# EAGLE design PB (EAGLE 9.5.2)
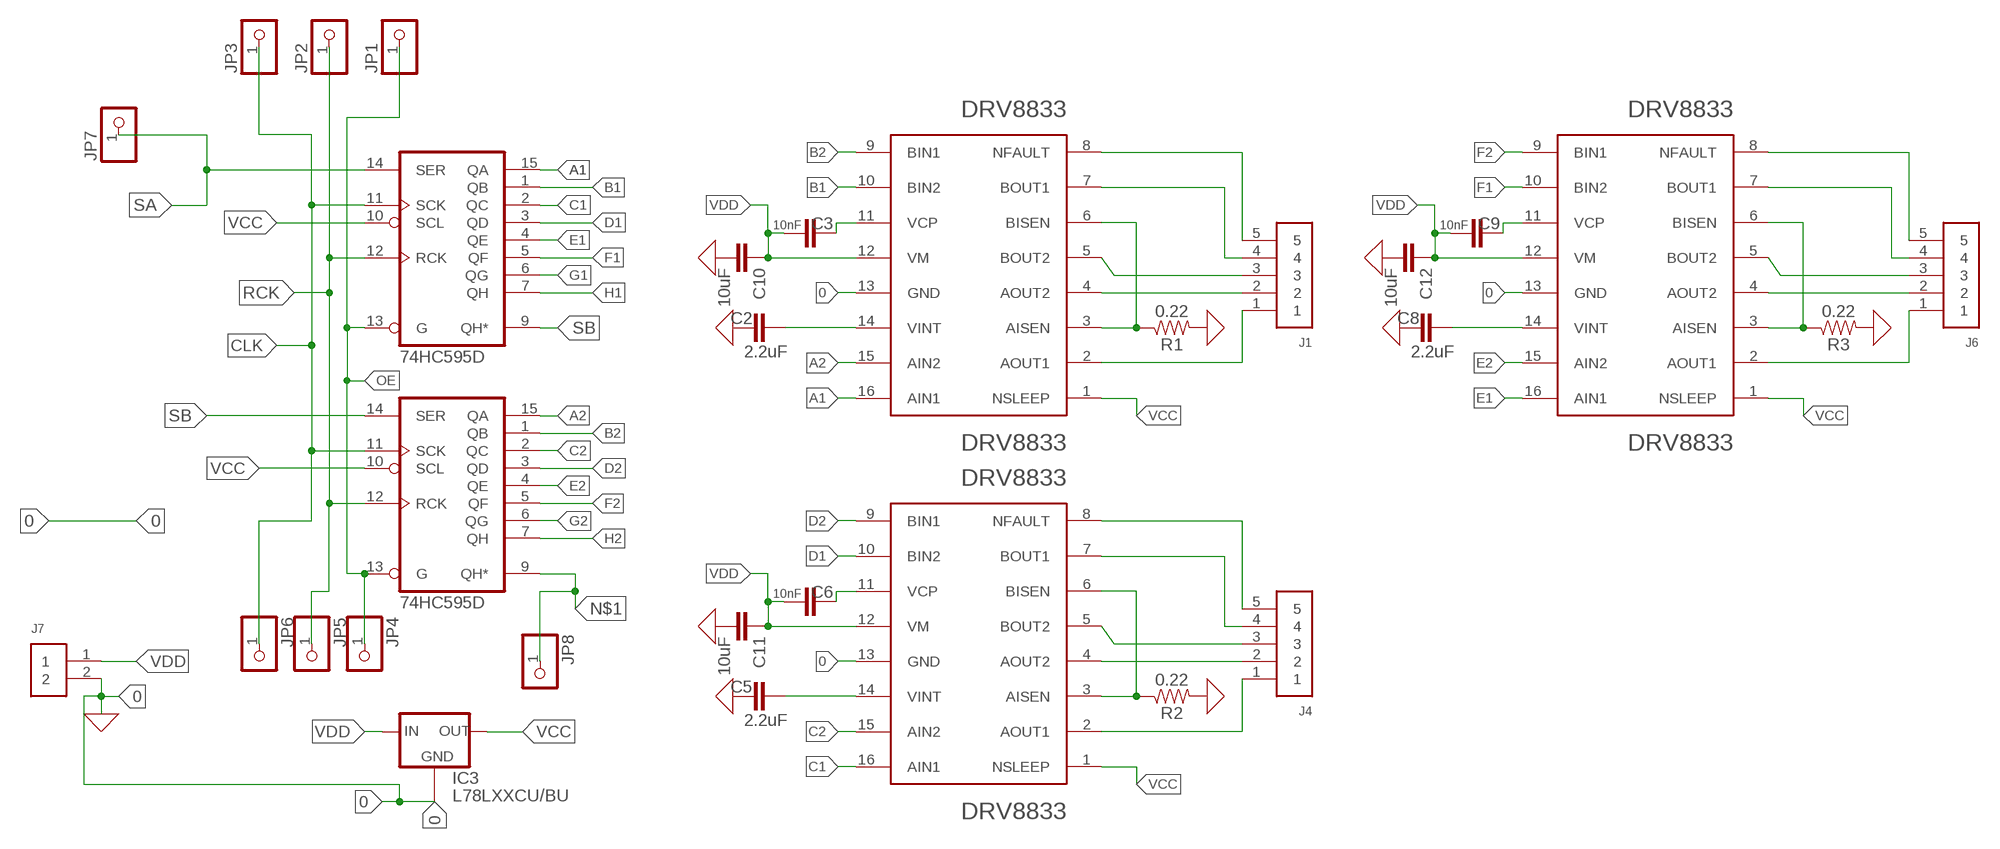
[diagram p0: schematic, sheet 1]

## Parts
C2  2.2uF  2.2UF-0603-10V-20%  [0603]
C3  10nF  10NF-0603-50V-10%  [0603]
C5  2.2uF  2.2UF-0603-10V-20%  [0603]
C6  10nF  10NF-0603-50V-10%  [0603]
C8  2.2uF  2.2UF-0603-10V-20%  [0603]
C9  10nF  10NF-0603-50V-10%  [0603]
C10  10uF  10UF-0805-10V-10%  [0805]
C11  10uF  10UF-0805-10V-10%  [0805]
C12  10uF  10UF-0805-10V-10%  [0805]
DRV8833PWP1  DRV8833  [SOP65P640X120-17N]
DRV8833PWP2  DRV8833  [SOP65P640X120-17N]
DRV8833PWP3  DRV8833  [SOP65P640X120-17N]
IC1  74HC595D  [SO16]
IC2  74HC595D  [SO16]
IC3  L78LXXCU/BU  [SOT89]
J1  61300511121  [61300511121]
J4  61300511121  [61300511121]
J6  61300511121  [61300511121]
J7  61300211121  [61300211121]
JP1  PINHD-1X1  [1X01]
JP2  PINHD-1X1  [1X01]
JP3  PINHD-1X1  [1X01]
JP4  PINHD-1X1  [1X01]
JP5  PINHD-1X1  [1X01]
JP6  PINHD-1X1  [1X01]
JP7  PINHD-1X1  [1X01]
JP8  PINHD-1X1  [1X01]
R1  0.22  0.22OHM-0805-1/4W-1%  [0805]
R2  0.22  0.22OHM-0805-1/4W-1%  [0805]
R3  0.22  0.22OHM-0805-1/4W-1%  [0805]

## Nets
0: C2.2 C5.2 C8.2 C10.2 C11.2 C12.2 DRV8833PWP1.13(GND) DRV8833PWP2.13(GND) DRV8833PWP3.13(GND) IC3.4(GND1) J7.2 R1.2 R2.2 R3.2 ; supply symbol labelled GND
A1: DRV8833PWP1.16(AIN1) IC1.15(QA)
A2: DRV8833PWP1.15(AIN2) IC2.15(QA)
B1: DRV8833PWP1.10(BIN2) IC1.1(QB)
B2: DRV8833PWP1.9(BIN1) IC2.1(QB)
C1: DRV8833PWP2.16(AIN1) IC1.2(QC)
C2: DRV8833PWP2.15(AIN2) IC2.2(QC)
CLK: IC1.11(SCK) IC2.11(SCK) JP3.1 JP6.1
D1: DRV8833PWP2.10(BIN2) IC1.3(QD)
D2: DRV8833PWP2.9(BIN1) IC2.3(QD)
E1: DRV8833PWP3.16(AIN1) IC1.4(QE)
E2: DRV8833PWP3.15(AIN2) IC2.4(QE)
F1: DRV8833PWP3.10(BIN2) IC1.5(QF)
F2: DRV8833PWP3.9(BIN1) IC2.5(QF)
G1: IC1.6(QG)
G2: IC2.6(QG)
H1: IC1.7(QH)
H2: IC2.7(QH)
N$1: IC2.9(QH*) JP8.1
N$2: C2.1 DRV8833PWP1.14(VINT)
N$3: C3.1 DRV8833PWP1.11(VCP)
N$4: DRV8833PWP1.3(AISEN) DRV8833PWP1.6(BISEN) R1.1
N$5: DRV8833PWP1.8(NFAULT) J1.5
N$6: DRV8833PWP1.7(BOUT1) J1.4
N$7: DRV8833PWP1.2(AOUT1) J1.1
N$8: DRV8833PWP1.4(AOUT2) J1.2
N$9: DRV8833PWP1.5(BOUT2) J1.3
N$10: C5.1 DRV8833PWP2.14(VINT)
N$13: C6.1 DRV8833PWP2.11(VCP)
N$14: DRV8833PWP2.3(AISEN) DRV8833PWP2.6(BISEN) R2.1
N$15: DRV8833PWP2.8(NFAULT) J4.5
N$16: DRV8833PWP2.7(BOUT1) J4.4
N$17: DRV8833PWP2.2(AOUT1) J4.1
N$19: DRV8833PWP2.4(AOUT2) J4.2
N$20: DRV8833PWP2.5(BOUT2) J4.3
N$21: C8.1 DRV8833PWP3.14(VINT)
N$22: C9.1 DRV8833PWP3.11(VCP)
N$23: DRV8833PWP3.3(AISEN) DRV8833PWP3.6(BISEN) R3.1
N$24: DRV8833PWP3.8(NFAULT) J6.5
N$26: DRV8833PWP3.7(BOUT1) J6.4
N$27: DRV8833PWP3.2(AOUT1) J6.1
N$28: DRV8833PWP3.4(AOUT2) J6.2
N$29: DRV8833PWP3.5(BOUT2) J6.3
OE: IC1.13(G) IC2.13(G) JP1.1 JP4.1
RCK: IC1.12(RCK) IC2.12(RCK) JP2.1 JP5.1
SA: IC1.14(SER) JP7.1
SB: IC1.9(QH*) IC2.14(SER)
VCC: DRV8833PWP1.1(NSLEEP) DRV8833PWP2.1(NSLEEP) DRV8833PWP3.1(NSLEEP) IC1.10(SCL) IC2.10(SCL) IC3.1(OUT)
VDD: C3.2 C6.2 C9.2 C10.1 C11.1 C12.1 DRV8833PWP1.12(VM) DRV8833PWP2.12(VM) DRV8833PWP3.12(VM) IC3.3(IN) J7.1
Unconnected: IC3.2(GND)

## Power pins joined to a net without a drawn wire
0: IC1.8(GND) IC2.8(GND)
VCC: IC1.16(VCC) IC2.16(VCC)

## Library data of the parts
C2 C5 C8 = SparkFun-Capacitors:2.2UF: 2.2µF ceramic capacitors A capacitor is a passive two-terminal electrical component used to store electrical energy temporarily in an electric field.; PROD_ID: CAP-07888
C3 C6 C9 = SparkFun-Capacitors:10NF: 0.01uF/10nF/10,000pF ceramic capacitors A capacitor is a passive two-terminal electrical component used to store electrical energy temporarily in an electric field. CAP-09321; PROD_ID: CAP-00867
C10-C12 = SparkFun-Capacitors:10UF: 10.0µF ceramic capacitors A capacitor is a passive two-terminal electrical component used to store electrical energy temporarily in an electric field.; PROD_ID: CAP-11330
DRV8833PWP1-DRV8833PWP3 = DRV8833PWP:DRV8833
IC1 IC2 = 74xx-eu:74*595: 8-bit SHIFT REGISTER, output latch
IC3 = v-reg-2:L78LXXCU/BU: VOLTAGE REGULATOR
J1 J4 J6 = Headers:61300511121: CONN HEADER VERT 5POS 2.54MM Manufacturer's datasheet <https://katalog.we-online.de/em/datasheet/6130xx11121.pdf>; CREATED_BY: PCBLayout.com; DIGI_KEY_PART_NUMBER: 732-5318-ND; MANUFACTURER: Wurth Electronics Inc.; MPN: 61300511121
J7 = Headers:61300211121: CONN HEADER VERT 2POS 2.54MM Manufacturer's datasheet <https://katalog.we-online.de/em/datasheet/6130xx11121.pdf>; CREATED_BY: PCBLayout.com; DIGI_KEY_PART_NUMBER: 732-5315-ND; MANUFACTURER: Wurth Electronics Inc.; MPN: 61300211121
JP1-JP8 = pinhead:PINHD-1X1: PIN HEADER
R1-R3 = SparkFun-Resistors:0.22OHM: 0.22Ω resistor A resistor is a passive two-terminal electrical component that implements electrical resistance as a circuit element. Resistors act to reduce current flow, and, at the same time, act to lower voltage levels within circuits. - Wikipedia; PROD_ID: RES-09883

## Board
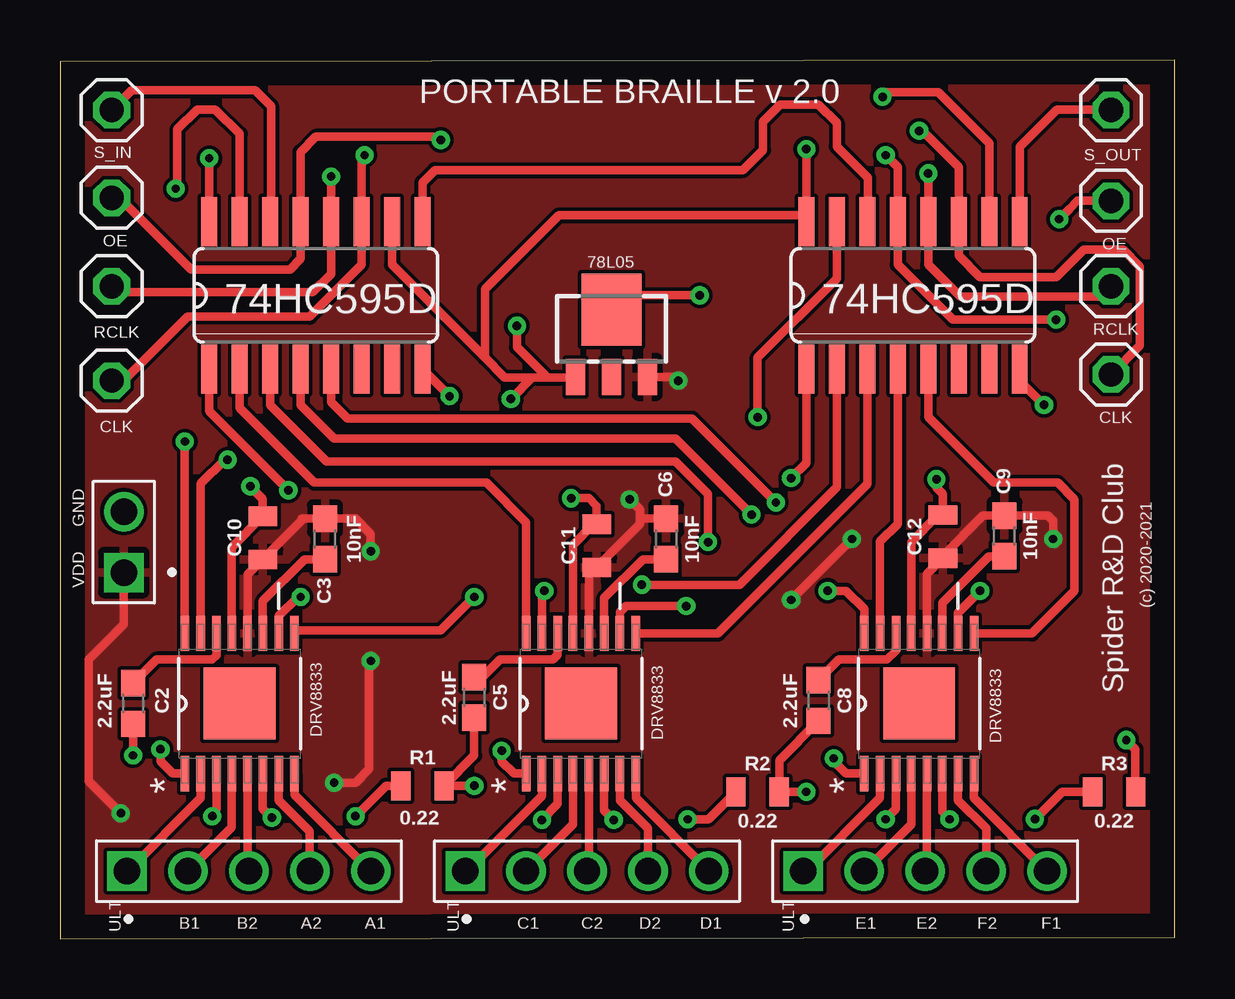
[diagram p1: board, top side]
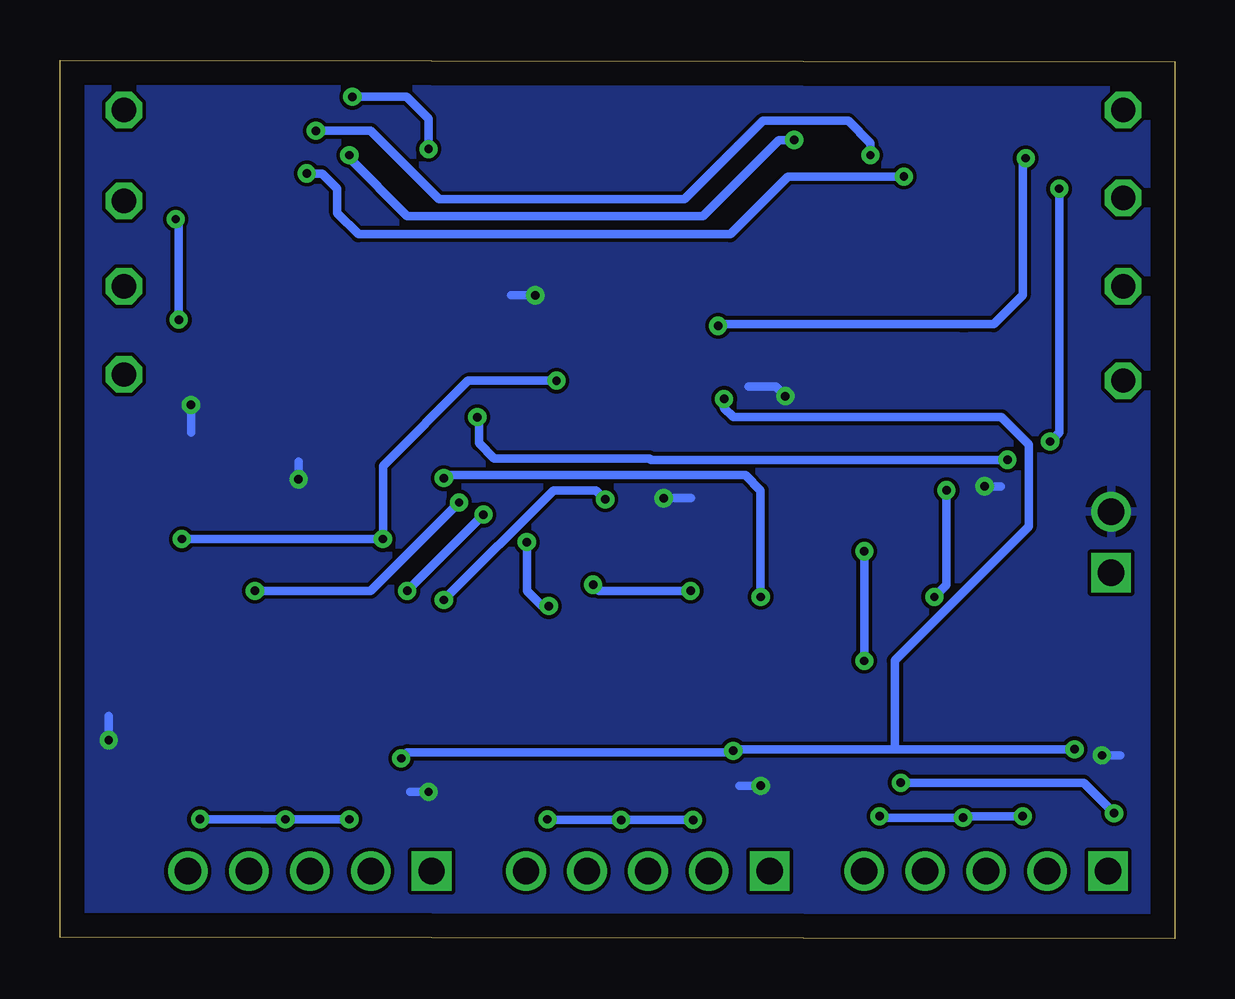
[diagram p2: board, bottom side, seen from below]

Size 46.48 x 36.64 mm. Coordinates in mm from the lower left corner, seen from the top.
Outline: 0,0 46.48,0.06 46.48,36.64 0,36.58 0,0
Copper layers (1*16): Top 0.035mm / dielectric 1.5mm / Bottom 0.035mm
Design rules "default": minimum track width 6mil, minimum drill 0.35mm, track to track 6mil, track to pad 6mil, pad to pad 6mil, via to via 6mil, smd to smd 6mil, copper to edge 40mil, drill to drill 6mil, minimum pad ring 10mil, minimum via ring 8mil, stop-mask expansion 4mil, vias tented up to drill 0mil, thermal gap 10mil

### Footprints (pad centres in the part's own frame; a part is rotated, then mirrored left to right if it is on the bottom)
0603 = smd 1.1 x 1: 1 -0.85,0; 2 0.85,0
0805 = smd 0.8 x 1.2: 1 -0.9,0; 2 0.9,0
SOP65P640X120-17N = smd 1.473 x 0.356: 1 -2.921,2.286; 2 -2.921,1.626; 3 -2.921,0.965; 4 -2.921,0.33; 5 -2.921,-0.33; 6 -2.921,-0.965; 7 -2.921,-1.626; 8 -2.921,-2.286; 9 2.921,-2.286; 10 2.921,-1.626; 11 2.921,-0.965; 12 2.921,-0.33; 13 2.921,0.33; 14 2.921,0.965; 15 2.921,1.626; 16 2.921,2.286 | smd 2.997 x 2.997: 17 0,0
SO16 = smd 0.66 x 2.032: 1 -4.445,-3.073; 2 -3.175,-3.073; 3 -1.905,-3.073; 4 -0.635,-3.073; 5 0.635,-3.073; 6 1.905,-3.073; 7 3.175,-3.073; 8 4.445,-3.073; 9 4.445,3.073; 10 3.175,3.073; 11 1.905,3.073; 12 0.635,3.073; 13 -0.635,3.073; 14 -1.905,3.073; 15 -3.175,3.073; 16 -4.445,3.073
SOT89 = smd 0.8 x 1.5: 1 -1.5,-1.75; 2 0,-1.75; 3 1.5,-1.75 | smd 2.5 x 3: 4 0,1.05
61300511121 = drill 1.1 square: 1 -5.08,0 | drill 1.1: 2 -2.54,0; 3 0,0; 4 2.54,0; 5 5.08,0
61300211121 = drill 1.1 square: 1 -1.27,0 | drill 1.1: 2 1.27,0
1X01 = drill 1.016 octagon: 1 0,0

### Placement (x,y rotation side)
C2  3.05,9.81 270 top
C3  11.05,16.67 90 top
C5  17.27,10.06 270 top
C6  25.27,16.67 90 top
C8  31.62,9.94 270 top
C9  39.37,16.8 90 top
C10  8.46,16.72 90 top
C11  22.37,16.39 90 top
C12  36.8,16.77 90 top
DRV8833PWP1  7.49,9.81 90 top
DRV8833PWP2  21.71,9.81 90 top
DRV8833PWP3  35.81,9.81 90 top
IC1  10.67,26.83 0 top
IC2  35.56,26.83 0 top
IC3  22.98,25.18 0 top
J1  7.87,2.83 0 top
J4  21.97,2.83 0 top
J6  36.07,2.83 0 top
J7  2.66,16.54 90 top
JP1  2.16,30.89 0 top
JP2  2.16,27.21 0 top
JP3  2.16,23.27 0 top
JP4  43.81,30.77 0 top
JP5  43.81,27.21 0 top
JP6  43.81,23.53 0 top
JP7  2.16,34.55 0 top
JP8  43.81,34.55 0 top
R1  15.11,6.38 0 top
R2  29.08,6.13 0 top
R3  43.94,6.13 0 top

### Tracks (layer width: path | path; a pad name or v marks a point on that pad's centre or on a via)
0  (via drill 0.35)
  Top 0.356: DRV8833PWP3.13 35.48,16.55 36.6,17.67 C12.2 36.8,18.55 36.54,18.81 v36.54,19.16 | DRV8833PWP2.13 21.38,16.43 22.25,17.29 C11.2 22.37,18.04 22.04,18.37 v21.31,18.37 | IC1.8 v16.24,22.62 | IC2.8 40.13,23.63 40.13,23.12 41.01,22.24 v41.02,22.26 | IC3.4 23.59,26.83 v26.67,26.83 | C2.2 v3.05,7.65 | C5.2 17.27,7.64 R1.2 v17.27,6.38 | C8.2 29.98,7.45 R2.2 v31.11,6.13 | R3.2 44.83,7.91 v44.45,8.29 | DRV8833PWP1.13 7.16,16.32 C10.2 8.46,18.34 v7.94,18.87
  Bottom 0.356: v16.24,22.62 16.63,23.02 17.78,23.02 | v26.67,26.83 27.68,26.83 | v41.02,22.26 41.02,21.11 | v3.05,7.65 2.28,7.65 | v17.27,6.38 18.16,6.38 | v31.11,6.13 31.87,6.13 | v44.45,8.29 44.45,9.3 | v7.94,18.87 7.26,18.87 | v21.31,18.37 20.17,18.37 | v36.54,19.16 36.54,19.89
  pour Bottom: 0.23,36.38 46.25,36.38 46.25,1.1 45.51,0.36 0.23,0.36
A1  (via drill 0.35)
  Top 0.356: IC1.15 7.49,33.56 6.47,34.58 5.71,34.58 4.89,33.75 4.89,31.27 v4.82,31.27 | v5.2,20.73 DRV8833PWP1.16
  Bottom 0.356: v4.82,31.27 4.82,21.11 v5.2,20.73
A2  (via drill 0.35)
  Top 0.356: DRV8833PWP1.15 5.86,18.98 6.86,19.97 v6.98,19.97 | IC2.15 32.38,27.53 29.08,24.23 v29.08,21.75
  Bottom 0.356: v6.98,19.97 21.84,19.97 21.9,20.03 28.38,20.03 29.02,20.67 29.02,21.68 v29.08,21.75
B1  (via drill 0.35)
  Top 0.356: IC1.1 6.22,22 v9.52,18.7 | v10.03,14.26 9.92,14.26 9.12,13.45 DRV8833PWP1.10
  Bottom 0.356: v9.52,18.7 9.52,14.76 v10.03,14.26
B2  (via drill 0.35)
  Top 0.356: DRV8833PWP1.9 9.9,12.86 15.87,12.86 v17.27,14.26 | IC2.1 31.11,19.84 v30.48,19.21
  Bottom 0.356: v17.27,14.26 17.27,18.7 17.9,19.34 30.35,19.34 v30.48,19.21
C1
  Top 0.356: IC1.2 7.49,22.13 10.6,19.02 17.78,19.02 19.43,17.37 DRV8833PWP2.16
C2  (via drill 0.35)
  Top 0.356: IC2.2 32.38,18.83 28.32,14.76 v24.25,14.76 | DRV8833PWP2.15 20.09,14.41 v20.19,14.51
  Bottom 0.356: v20.19,14.51 24,14.51 v24.25,14.76
CLK  (via drill 0.35)
  Top 0.356: JP3.1 2.66,23.27 5.33,25.94 10.41,25.94 12.57,28.1 IC1.11 12.57,32.54 v12.7,32.67 | JP6.1 45.02,24.73 45.02,28.04 44.32,28.73 42.67,28.73 41.53,27.59 38.35,27.59 37.46,28.48 IC2.11 37.46,32.16 35.87,33.75 v35.81,33.69
  Bottom 0.356: v35.81,33.69 33.53,33.69 30.67,30.83 20.44,30.83 17.17,34.1 13.62,34.1 12.7,33.18 v12.7,32.67
D1  (via drill 0.35)
  Top 0.356: DRV8833PWP2.10 23.34,13.62 23.59,13.87 v26.1,13.87 | IC1.3 8.76,22.26 11.11,19.91 25.65,19.91 27.02,18.54 v27.02,16.54
  Bottom 0.356: v27.02,16.54 27.02,14.51 26.38,13.87 v26.1,13.87
D2
  Top 0.356: IC2.3 33.65,18.95 27.43,12.73 DRV8833PWP2.9
E1  (via drill 0.35)
  Top 0.356: IC1.4 10.03,22.26 11.43,20.86 25.65,20.86 v28.83,17.68 | v32,14.51 32.76,14.51 33.53,13.75 DRV8833PWP3.16
  Bottom 0.356: v28.83,17.68 v32,14.51
E2
  Top 0.356: DRV8833PWP3.15 34.19,16.57 34.92,17.3 IC2.4
F1  (via drill 0.35)
  Top 0.356: IC1.5 11.3,22.38 12,21.68 26.35,21.68 v29.84,18.19 | v38.35,14.51 37.44,13.6 DRV8833PWP3.10
  Bottom 0.356: v29.84,18.19 33.53,14.51 v38.35,14.51
F2
  Top 0.356: IC2.5 36.19,21.75 38.92,19.02 41.59,19.02 42.29,18.32 42.29,14.51 40.51,12.73 DRV8833PWP3.9
N$1
  Top 0.356: IC2.9 40,33.03 41.55,34.58 43.79,34.58 JP8.1
N$2
  Top 0.356: DRV8833PWP1.14 6.53,11.82 6.35,11.64 4.02,11.64 C2.1
N$3
  Top 0.356: DRV8833PWP1.11 8.46,14.08 10.2,15.82 C3.1
N$4  (via drill 0.35)
  Top 0.356: v8.83,5.06 8.46,5.43 DRV8833PWP1.6 | v12.32,5.11 13.59,6.38 R1.1 | DRV8833PWP1.3 6.53,5.42 6.35,5.24 v6.35,5.11
  Bottom 0.356: v12.32,5.11 12.32,5.06 v8.83,5.06 8.77,5.11 v6.35,5.11
N$5
  Top 0.356: DRV8833PWP1.8 9.78,6 J1.5
N$6
  Top 0.356: DRV8833PWP1.7 9.12,5.77 10.41,4.48 J1.4
N$7
  Top 0.356: DRV8833PWP1.2 5.86,5.87 2.82,2.83 J1.1
N$8
  Top 0.356: DRV8833PWP1.4 7.16,4.65 J1.2
N$9
  Top 0.356: DRV8833PWP1.5 7.82,2.88 J1.3
N$10
  Top 0.356: DRV8833PWP2.14 20.75,11.84 20.55,11.64 18.34,11.64 17.61,10.91 C5.1
N$13
  Top 0.356: DRV8833PWP2.11 22.68,14.2 24.29,15.82 C6.1
N$14  (via drill 0.35)
  Top 0.356: DRV8833PWP2.6 22.68,5.37 v23.09,4.96 | v26.16,4.98 27.04,4.98 R2.1 | DRV8833PWP2.3 20.75,5.62 v20.09,4.96
  Bottom 0.356: v26.16,4.98 26.16,4.96 v23.09,4.96 v20.09,4.96
N$15
  Top 0.356: J4.5 24,5.87 DRV8833PWP2.8
N$16
  Top 0.356: DRV8833PWP2.7 23.34,5.77 24.51,4.6 J4.4
N$17
  Top 0.356: DRV8833PWP2.2 20.09,5.96 16.95,2.83 J4.1
N$19
  Top 0.356: DRV8833PWP2.4 21.38,4.78 J4.2
N$20
  Top 0.356: J4.3 22.04,2.9 DRV8833PWP2.5
N$21
  Top 0.356: DRV8833PWP3.14 34.85,12.01 34.48,11.64 32.47,11.64 C8.1
N$22
  Top 0.356: DRV8833PWP3.11 36.78,14 38.72,15.95 C9.1
N$23  (via drill 0.35)
  Top 0.356: v40.64,4.99 41.77,6.13 R3.1 | DRV8833PWP3.6 36.78,5.29 v37.08,4.98 | v34.41,4.98 34.85,5.42 DRV8833PWP3.3
  Bottom 0.356: v40.64,4.99 38.1,4.99 38.09,4.98 v37.08,4.98 v34.41,4.98
N$24
  Top 0.356: DRV8833PWP3.8 38.1,5.87 J6.5
N$26
  Top 0.356: DRV8833PWP3.7 37.44,5.77 38.61,4.6 J6.4
N$27
  Top 0.356: DRV8833PWP3.2 34.19,5.87 31.14,2.83 J6.1
N$28
  Top 0.356: DRV8833PWP3.4 35.48,4.78 J6.2
N$29
  Top 0.356: DRV8833PWP3.5 36.14,2.9 J6.3
OE  (via drill 0.35)
  Top 0.356: v41.65,30 42.1,30.45 42.42,30.77 JP4.1 | v41.53,25.81 37.21,25.81 34.92,28.1 IC2.13 34.92,32.16 v34.41,32.67 | JP1.1 2.47,30.89 5.46,27.91 9.59,27.91 10.03,28.35 IC1.13 10.03,32.8 10.67,33.43 15.87,33.43 v15.87,33.31
  Bottom 0.356: v41.53,25.81 41.53,29.88 v41.65,30 | 16.51,33.31 19.68,30.13 32,30.13 34.41,32.54 v34.41,32.67 | v15.87,33.31 16.51,33.31 | 16.51,33.31
RCK  (via drill 0.35)
  Top 0.356: JP2.1 2.41,26.96 10.54,26.96 11.3,27.72 IC1.12 v11.3,31.78 | JP5.1 43.37,26.77 37.53,26.77 36.19,28.1 IC2.12 v36.19,31.91
  Bottom 0.356: v36.19,31.91 35.56,31.91 34.92,31.27 34.92,30.26 34.03,29.37 18.54,29.37 16.13,31.78 v11.3,31.78
SA
  Top 0.356: JP7.1 2.99,35.39 3.52,35.39 8.13,35.39 8.8,34.71 8.8,29.94 IC1.14
SB
  Top 0.356: IC1.9 15.11,31.53 15.63,32.05 28.47,32.05 29.3,32.88 29.3,34.07 30.02,34.78 31.62,34.78 32.38,34.02 32.38,33.03 33.68,31.73 33.68,29.93 IC2.14
VCC  (via drill 0.35)
  Top 0.356: DRV8833PWP3.1 32.76,6.89 32.26,7.4 v32.26,7.52 | DRV8833PWP1.1 4.7,6.89 4.19,7.4 v4.19,7.91 | DRV8833PWP2.1 18.92,6.89 18.41,7.4 v18.41,7.84 | IC1.10 13.84,28.1 17.71,24.23 | 17.71,24.23 18.54,23.4 19.68,23.4 | 19.68,23.4 20.32,23.4 | 20.32,23.4 21.46,23.4 IC3.1 | 17.71,24.23 17.71,27.08 20.79,30.16 30.85,30.16 IC2.16 v31.11,32.92 | IC2.10 38.73,33.18 36.61,35.3 34.29,35.3 v34.29,35.1 | v34.29,35.1 | IC1.16 v6.22,32.54 | v19.05,25.56 19.05,24.67 20.32,23.4 | 19.68,23.4 v18.79,22.51
  Bottom 0.356: v32.26,7.52 32,7.78 18.48,7.78 v18.41,7.84 18.35,7.91 11.68,7.91 | 11.68,7.91 v4.19,7.91 | v19.05,25.56 19.05,25.62 8.89,25.62 8.7,25.62 7.55,25.62 6.35,26.83 6.35,32.42 v6.22,32.54 | v18.79,22.51 18.79,22.13 18.41,21.75 7.24,21.75 6.09,20.61 6.09,17.19 11.68,11.6 11.68,7.91 | v31.11,32.92 31.11,34.19 32.02,35.1 v34.29,35.1
VDD  (via drill 0.35)
  Top 0.356: 24.18,17.52 C6.2 | IC3.3 25.78,23.43 v25.78,23.27 | v33.02,16.67 v30.48,14.13 | v23.75,18.32 24.18,17.89 24.18,17.52 | J7.1 2.66,13.11 1.2,11.65 1.2,6.57 v2.54,5.24 | v11.43,6.51 12.32,6.51 12.89,7.08 12.89,11.59 v12.95,11.59 | v12.95,16.16 12.95,16.88 12.32,17.52 C3.2 10.08,17.52 10.08,17.44 C10.1 7.82,15.18 DRV8833PWP1.12 | v41.4,16.67 41.4,17.43 41.18,17.65 C9.2 38.48,17.65 36.8,15.97 C12.1 36.14,15.21 DRV8833PWP3.12 | 24.18,17.52 24.18,17.29 C11.1 22.04,15.16 DRV8833PWP2.12
  Bottom 0.356: v25.78,23.27 29.46,23.27 33.02,19.72 v33.02,16.67 v41.4,16.67 | v30.48,14.13 25.91,18.7 24.13,18.7 v23.75,18.32 | v2.54,5.24 3.81,6.51 v11.43,6.51 | v12.95,11.59 v12.95,16.16
  pour Top: 0.2,36.38 0.2,0.51 45.11,0.51 46.3,1.71 46.3,36.38

### Text on the board
tPlace: PORTABLE BRAILLE v 2.0 | S_IN | S_OUT | OE | OE | 78L05 | RCLK | RCLK | CLK | CLK | Spider R&D Club | GND | VDD | (c) 2020-2021 | DRV8833 | DRV8833 | DRV8833 | ULT | B1 | B2 | A2 | A1 | ULT | C1 | C2 | D2 | D1 | ULT | E1 | E2 | F2 | F1